# Altium schematic sheet S4_Power_Supply.SchDoc: Power Supply
size Tabloid; DrawnBy: Dhrumil Parikh; SheetNumber: 4; SheetTotal: 6; PageSetup: Record=PageOptions|CenterHorizontal=True|CenterVertical=True|PrintScale=0.62|XCorrection=1.00|YCorrection=1.00|PrintKind=1|BorderSize=5000000|LeftOffset=0|BottomOffset=0|Orientation=2|PaperLength=1000|PaperWidth=1000|Scale=100|PaperSource=7|PrintQuality=600|MediaType=1|DitherType=10|PaperKind=Letter|PrintScaleMode=1; PageSize: T
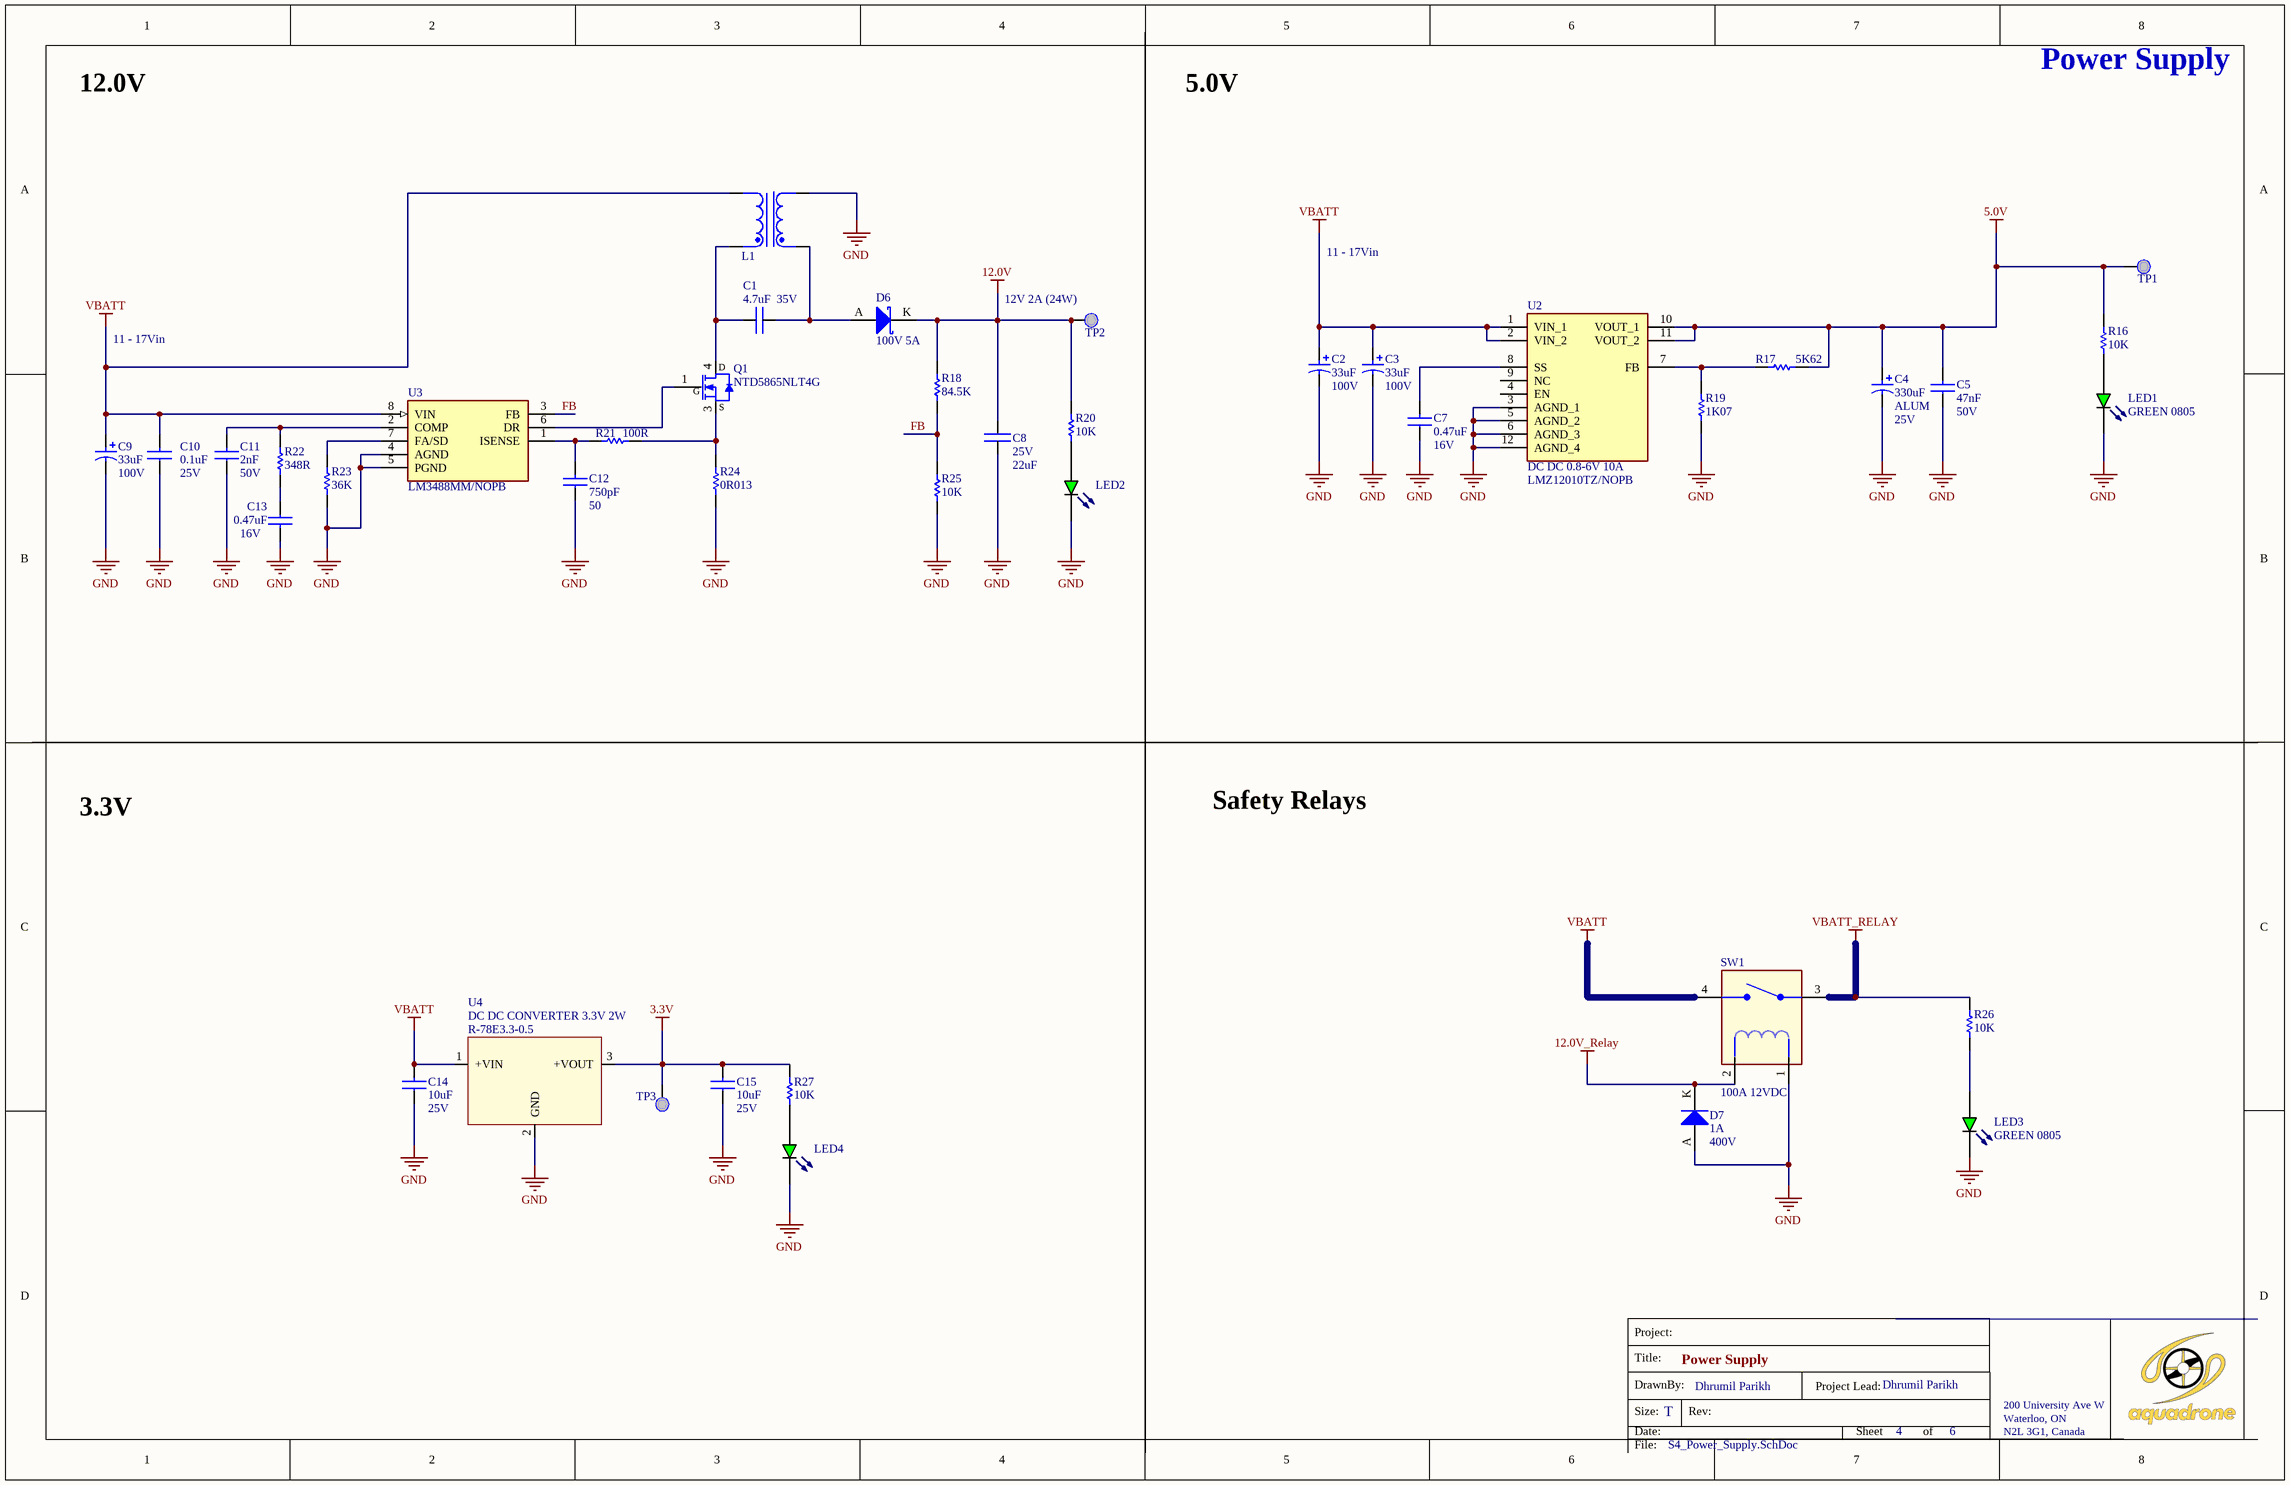
[diagram p0: S4_Power_Supply.SchDoc]

## Parts
C1  value 4.7uF  VOLTAGE: 35V  [CAPC2012X14N]  (hidden comment: CAP CER 4.7UF 35V X5R 0805)
C2  value 33uF  VOLTAGE: 100V  [CAPPRD350W60D825H1700]  (hidden comment: CAP ALUM 33UF 20% 100V RADIAL)
C3  value 33uF  VOLTAGE: 100V  [CAPPRD350W60D825H1700]  (hidden comment: CAP ALUM 33UF 20% 100V RADIAL)
C4  value 330uF  DIELECTRIC: ALUM  VOLTAGE: 25V  [CAPPRD350W60D850H1300]  (hidden comment: CAP ALUM 330UF 20% 25V TH)
C5  value 47nF  VOLTAGE: 50V  [CAPC1608X09N]  (hidden comment: CAP CER 0.047UF 50V X7R 0603)
C7  value 0.47uF  VOLTAGE: 16V  [CAPC1608X09N]  (hidden comment: CAP CER 0.47UF 16V X7R 0603)
C8  value 22uF  VOLTAGE: 25V  [CAPC3225X28N]  (hidden comment: CAP CER 22UF 25V X7R 1210)
C9  value 33uF  VOLTAGE: 100V  [CAPPRD350W60D825H1700]  (hidden comment: CAP ALUM 33UF 20% 100V RADIAL)
C10  value 0.1uF  VOLTAGE: 25V  [CAPC1608X09N]  (hidden comment: CAP CER 0.1UF 25V X7R 0603)
C11  value 2nF  VOLTAGE: 50V  [CAPC1608X09N]  (hidden comment: CAP CER 2000PF 50V X7R 0603)
C12  value 750pF  VOLTAGE: 50  [CAPC1608X09N]  (hidden comment: CAP CER 750PF 50V X7R 0603)
C13  value 0.47uF  VOLTAGE: 16V  [CAPC1608X09N]  (hidden comment: CAP CER 0.47UF 16V X7R 0603)
C14  value 10uF  VOLTAGE: 25V  [CAPC1608X09N]  (hidden comment: CAP CER 10UF 25V X5R 0603)
C15  value 10uF  VOLTAGE: 25V  [CAPC1608X09N]  (hidden comment: CAP CER 10UF 25V X5R 0603)
D6  value 100V 5A  [SODFL5226X100N]  (hidden comment: DIODE SCHOTTKY 100V 5A DO221AC)
D7  CURRENT: 1A  VR: 400V  [DIOM5226X295N]  (hidden comment: DIODE GEN PURP 400V 1A SMA)
L1  INDUCT ARRAY 2 COIL 9.654UH SMD  [DRQ125100R]  (value not drawn)
LED1  value GREEN 0805  [LED0805]  (hidden comment: LED GREEN CLEAR 0805 SMD)
LED2  LED GREEN CLEAR 0805 SMD  [LED0805]  (value not drawn)
LED3  value GREEN 0805  [LED0805]  (hidden comment: LED GREEN CLEAR 0805 SMD)
LED4  LED GREEN CLEAR 0805 SMD  [LED0805]  (value not drawn)
Q1  MFG_PART_NO: NTD5865NLT4G  [TO229P990X238-4N]  (hidden comment: MOSFET N-CH 60V 46A DPAK)
R16  value 10K  [RESC1608X06N]  (hidden comment: RES SMD 10K OHM 1% 1/10W 0603)
R17  value 5K62  [RESC1608X06N]  (hidden comment: RES SMD 5.62K OHM 1% 1/10W 0603)
R18  value 84.5K  [RESC1608X06N]  (hidden comment: RES SMD 84.5K OHM 1% 1/10W 0603)
R19  value 1K07  [RESC1608X06N]  (hidden comment: RES SMD 1.07K OHM 1% 1/10W 0603)
R20  value 10K  [RESC1608X06N]  (hidden comment: RES SMD 10K OHM 1% 1/10W 0603)
R21  value 100R  [RESC1608X06N]  (hidden comment: RES SMD 100 OHM 1% 1/10W 0603)
R22  value 348R  [RESC1608X06N]  (hidden comment: RES SMD 348 OHM 1% 1/10W 0603)
R23  value 36K  [RESC1608X06N]  (hidden comment: RES SMD 36K OHM 1% 0.15W 0603)
R24  value 0R013  [RESC1632X60N]  (hidden comment: RES 0.013 OHM 1W 1206 WIDE)
R25  value 10K  [RESC1608X06N]  (hidden comment: RES SMD 10K OHM 1% 1/10W 0603)
R26  value 10K  [RESC1608X06N]  (hidden comment: RES SMD 10K OHM 1% 1/10W 0603)
R27  value 10K  [RESC1608X06N]  (hidden comment: RES SMD 10K OHM 1% 1/10W 0603)
SW1  value 100A 12VDC  [G7EB-1A DC12]  (hidden comment: RELAY GEN PURPOSE SPST-NO 100A 12VDC)
TP1  Testpoint 1mm SMD Pad  [TP_SMD_1.0MM]  (value not drawn)  (no BOM)
TP2  Testpoint 1mm SMD Pad  [TP_SMD_1.0MM]  (value not drawn)  (no BOM)
TP3  Testpoint 1mm SMD Pad  [TP_SMD_1.0MM]  (value not drawn)  (no BOM)
U2  value DC DC 0.8-6V 10A  MFG_PART_NO: LMZ12010TZ/NOPB  [LMZ12010TZENOPB]  (hidden comment: DC DC CONVERTER 0.8-6V 10A)
U3  MFG_PART_NO: LM3488MM/NOPB  [SOP65P490X110-8N]  (hidden comment: IC REG CTRLR MULT TOP 8VSSOP)
U4  MFG_PART_NO: R-78E3.3-0.5  [SHDRV3W100P0_254_1X3_1160X850X1040P]  (hidden comment: DC DC CONVERTER 3.3V 2W)

## Nets
3.3V: C15.2 R27.2 TP3.1 U4.3(+VOUT)
5.0V: C4.1 C5.2 R16.2 R17.2 TP1.1 U2.10(VOUT_1) U2.11(VOUT_2)
12.0V: C8.1 D6.K R18.2 R20.2 TP2.1
12.0V_Relay: D7.K SW1.2
GND: C2.2 C3.2 C4.2 C5.1 C7.1 C8.2 C9.2 C10.1 C11.1 C12.1 C13.2 C14.1 C15.1 D7.A L1.3 LED1.K LED2.K LED3.K LED4.K R19.1 R23.1 R24.1 R25.1 SW1.1 U2.3(AGND_1) U2.5(AGND_2) U2.6(AGND_3) U2.12(AGND_4) U3.4(AGND) U3.5(PGND) U4.2(GND)
VBATT: C2.1 C3.1 C9.1 C10.2 C14.2 L1.4 SW1.4 U2.1(VIN_1) U2.2(VIN_2) U3.8(VIN) U4.1(+VIN)
VBATT_RELAY: R26.2 SW1.3
FB: R18.1 R25.2 U3.3(FB)
NetC1_1: C1.1 L1.2 Q1.4(D)
NetC1_2: C1.2 D6.A L1.1
NetC7_2: C7.2 U2.8(SS)
NetC11_2: C11.2 R22.2 U3.2(COMP)
NetC12_2: C12.2 R21.1 U3.1(ISENSE)
NetC13_1: C13.1 R22.1
NetLED1_A: LED1.A R16.1
NetLED2_A: LED2.A R20.1
NetLED3_A: LED3.A R26.1
NetLED4_A: LED4.A R27.1
NetQ1_1: Q1.1(G) U3.6(DR)
NetQ1_3: Q1.3(S) R21.2 R24.2
NetR17_1: R17.1 R19.2 U2.7(FB)
NetR23_2: R23.2 U3.7(FA/SD)

Not connected (* = marked no-connect by the designer): U2 4(EN) 9(NC)

## Notes on the sheet
- 12.0V
- 5.0V
- (near TP2) 12V 2A (24W)
- 11 - 17Vin
- 3.3V
- Safety Relays
- Title:
- Project:
- Size:
- Date:
- DrawnBy:
- Rev:
- Project Lead:
- Sheet
- Dhrumil Parikh
- of
- 200 University Ave W
- Waterloo, ON
- N2L 3G1, Canada
- File:

## Library data of the parts
C1 = CAP CER 4.7UF 35V X5R 0805: MFG_PART_NO: GRM219R6YA475KA73D; MFG: Murata Electronics; COST: 0.40
C2 C3 C9 = CAP ALUM 33UF 20% 100V RADIAL: MFG_PART_NO: UPM2A330MPD1TD; MFG: Nichicon; COST: 0.18; TOLERANCE: 20%; DIELECTRIC: ALUM
C4 = CAP ALUM 330UF 20% 25V TH: MFG_PART_NO: ESL337M025AGMAA; MFG: KEMET; COST: 0.53; TOLERANCE: 20%
C5 = CAP CER 0.047UF 50V X7R 0603: MFG_PART_NO: CC0603KRX7R9BB473; MFG: Yageo; TOLERANCE: 10%; COST: 0.14; DIELECTRIC: X7R
C7 C13 = CAP CER 0.47UF 16V X7R 0603: MFG_PART_NO: CL10B474KO8NNNC; MFG: Samsung; TOLERANCE: 10%; COST: 0.14; DIELECTRIC: X7R
C8 = CAP CER 22UF 25V X7R 1210: MFG_PART_NO: TMK325B7226KMHP; MFG: Taiyo Yuden; TOLERANCE: 20%; DIELECTRIC: X7S; COST: 1.55
C10 = CAP CER 0.1UF 25V X7R 0603: MFG_PART_NO: CC0603KRX7R8BB104; MFG: Yageo; TOLERANCE: 10%; COST: 0.14; DIELECTRIC: X7R
C11 = CAP CER 2000PF 50V X7R 0603: MFG_PART_NO: CC0603KRX7R9BB202; MFG: Yageo; TOLERANCE: 10%; COST: 0.14; DIELECTRIC: X7R
C12 = CAP CER 750PF 50V X7R 0603: MFG_PART_NO: CC0603KRX7R9BB751; MFG: Yageo; TOLERANCE: 10%; COST: 0.16; DIELECTRIC: X7R
C14 C15 = CAP CER 10UF 25V X5R 0603: MFG_PART_NO: C1608X5R1E106M080AC; MFG: KEMET; TOLERANCE: 20%; COST: 0.14; DIELECTRIC: X5R
D6 = DIODE SCHOTTKY 100V 5A DO221AC: MFG_PART_NO: VSSAF510-M3/H; MFG: Vishay; VF: 750mV; COST: 0.55; CURRENT: 5A; VR: 100V
D7 = DIODE GEN PURP 400V 1A SMA: MFG_PART_NO: S1GTR; MFG: SMC Diode Solutions; VALUE: S1GTR; COST: 0.17
L1 = INDUCT ARRAY 2 COIL 9.654UH SMD: MFG_PART_NO: DRQ125-100-R; MFG: Eaton; VALUE: 9.654µH
LED1-LED4 = LED GREEN CLEAR 0805 SMD: MFG_PART_NO: 150080VS75000; MFG: Würth Elektronik; COST: 0.26
  LED2 LED4: VALUE: GREEN 0805
Q1 = MOSFET N-CH 60V 46A DPAK: MFG: ON Semiconductor; VALUE: 16mOhm @ 20A, 10V; COST: 0.97
R16 R20 R25-R27 = RES SMD 10K OHM 1% 1/10W 0603: MFG_PART_NO: CRCW060310K0FKEA; MFG: Vishay Dale; COST: 0.15; TOLERANCE: 1%
R17 = RES SMD 5.62K OHM 1% 1/10W 0603: MFG_PART_NO: RC0603FR-075K62L; MFG: Yageo; COST: 0.15; TOLERANCE: 1%
R18 = RES SMD 84.5K OHM 1% 1/10W 0603: MFG_PART_NO: RC0603FR-0784K5L; MFG: Yageo; COST: 0.15; TOLERANCE: 1%
R19 = RES SMD 1.07K OHM 1% 1/10W 0603: MFG_PART_NO: RC0603FR-071K07L; MFG: Yageo; COST: 0.15; TOLERANCE: 1%
R21 = RES SMD 100 OHM 1% 1/10W 0603: MFG_PART_NO: RC0603FR-07100RL; MFG: Yageo; COST: 0.15; TOLERANCE: 1%
R22 = RES SMD 348 OHM 1% 1/10W 0603: MFG_PART_NO: RC0603FR-07348RL; MFG: Yageo; COST: 0.15; TOLERANCE: 1%
R23 = RES SMD 36K OHM 1% 0.15W 0603: MFG_PART_NO: RC0603FR-0736KL; MFG: Yageo; COST: 0.15; TOLERANCE: 1%
R24 = RES 0.013 OHM 1W 1206 WIDE: MFG_PART_NO: PRL1632-R013-F-T1; MFG: Susumu; TOLERANCE: 1%; COST: 1
SW1 = RELAY GEN PURPOSE SPST-NO 100A 12VDC: MFG: Omron; COST: 42.86; MFG_PART_NO: G7EB-1A DC12
TP1-TP3 = Testpoint 1mm SMD Pad: Testpoint 1.0mm SMD Pad; VALUE: TP_SMD_1.0MM; ROHS: Y; STATUS: CHECKED
U2 = DC DC CONVERTER 0.8-6V 10A: MFG: TI; COST: 24.09
U3 = IC REG CTRLR MULT TOP 8VSSOP: MFG: TI; VALUE: LM3488MM/NOPB; COST: 3.29
U4 = DC DC CONVERTER 3.3V 2W: MFG: Recom Power; COST: 3.86; VALUE: DC DC CONVERTER 3.3V 2W